# Altium schematic sheet v1.0.SchDoc
size 203 x 114 mm; PageSetup: Record=PageOptions|CenterHorizontal=True|CenterVertical=True|PrintScale=0.86|XCorrection=1.00|YCorrection=1.00|PrintKind=1|BorderSize=5000000|LeftOffset=0|BottomOffset=0|Orientation=2|PaperLength=1000|PaperWidth=1000|Scale=100|PaperSource=15|PrintQuality=3600|MediaType=1|DitherType=10|PrintScaleMode=1|PaperKind=A4|PaperIndex=9
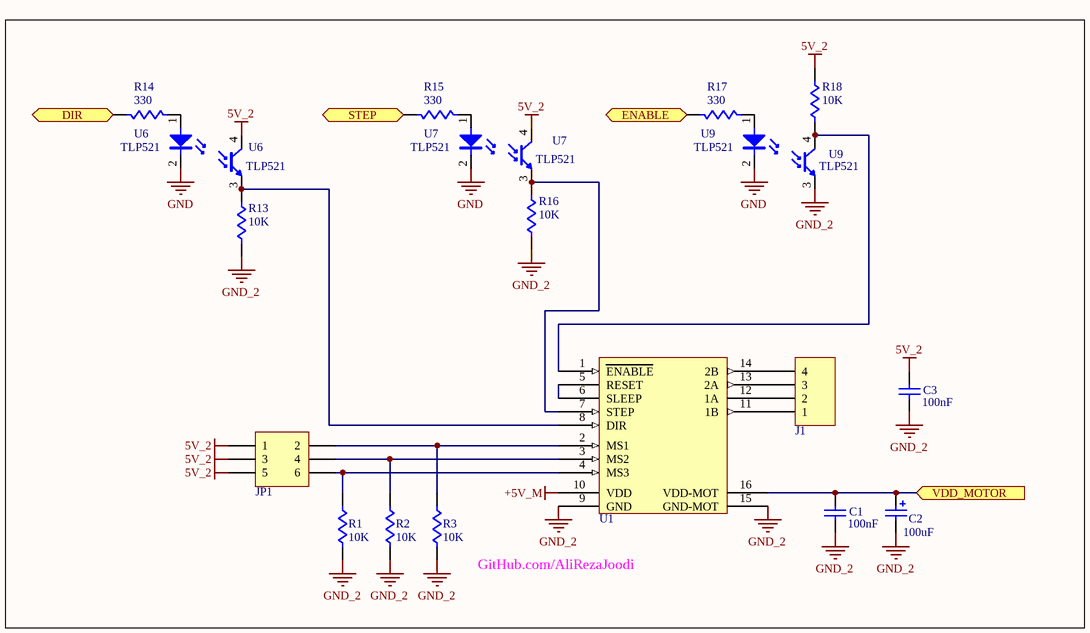
[diagram p0: v1.0.SchDoc]

## Parts
C1  C1  value 100nF  [CAPNTO2.54-3.05x1.78A]
C2  C2  value 100uF  [CAPPR3.05-3.81x6.35]
C3  C3  value 100nF  [CAPNTO2.54-3.05x1.78A]
J1  J1  [Fonics_4PIN_1]
JP1  JP1  [HDR2X3]
R1  R1  value 10K  [AXIAL-0.4]
R2  R2  value 10K  [AXIAL-0.4]
R3  R3  value 10K  [AXIAL-0.4]
R13  R13  value 10K  [AXIAL-0.4]
R14  R14  value 330  [AXIAL-0.4]
R15  R15  value 330  [AXIAL-0.4]
R16  R16  value 10K  [AXIAL-0.4]
R17  R17  value 330  [AXIAL-0.4]
R18  R18  value 10K  [AXIAL-0.4]
U1  U1  [Reprap-A4988]
U6  U6  value TLP521  [DIP4e]  (parts A,B of 2)
U7  U7  value TLP521  [DIP4e]  (parts A,B of 2)
U9  U9  value TLP521  [DIP4e]  (parts A,B of 2)

## Ports
DIR (in), ENABLE (in), STEP (in), VDD_MOTOR (in)

## Nets
5V_2: C3.1 JP1.1 JP1.3 JP1.5 R18.1 U6.4(C) U7.4(C)
+5V_M: U1.10(VDD)
GND: U6.2(K) U7.2(K) U9.2(K)
GND_2: C1.2 C2.2 C3.2 R1.2 R2.2 R3.2 R13.2 R16.2 U1.9(GND) U1.15(GND-MOT) U9.3(E)
DIR: R14.2 ; port DIR
ENABLE: R17.2 ; port ENABLE
STEP: R15.2 ; port STEP
VDD_MOTOR: C1.1 C2.1 U1.16(VDD-MOT) ; port VDD_MOTOR
NetJ1_1: J1.1 U1.11(1B)
NetJ1_2: J1.2 U1.12(1A)
NetJ1_3: J1.3 U1.13(2A)
NetJ1_4: J1.4 U1.14(2B)
NetJP1_2: JP1.2 R3.1 U1.2(MS1)
NetJP1_4: JP1.4 R2.1 U1.3(MS2)
NetJP1_6: JP1.6 R1.1 U1.4(MS3)
NetR13_1: R13.1 U1.8(DIR) U6.3(E)
NetR14_1: R14.1 U6.1(A)
NetR15_1: R15.1 U7.1(A)
NetR16_1: R16.1 U1.7(STEP) U7.3(E)
NetR17_1: R17.1 U9.1(A)
NetR18_2: R18.2 U1.1(ENABLE) U9.4(C)
NetU1_5: U1.5(RESET) U1.6(SLEEP)

## Notes on the sheet
- GitHub.com/AliRezaJoodi

## Library data of the parts
C1 C3 = Cap: Capacitor; Manufacturer: Generic Components; Class I: Passive; Published: 8-Jun-2000; Revision: July-2002: Re-released for DXP Platform.; Publisher: Altium Limited; Class II: Capacitor
C2 = Cap Pol1: Polarized Capacitor (Radial); Manufacturer: Generic Components; Class I: Passive; Published: 8-Jun-2000; Revision: July-2002: Re-released for DXP Platform.; Publisher: Altium Limited; Class II: Capacitor
J1 = Header 4: Header, 4-Pin; Manufacturer: Generic Components; Class I: Connector; Revision: July-2002: Re-released for DXP Platform.; Publisher: Altium Limited
JP1 = Header 3X2: Header, 3-Pin, Dual row; Manufacturer: Generic Components; Class I: Connector; Revision: July-2002: Re-released for DXP Platform.; Publisher: Altium Limited
R1-R3 R13-R18 = Res1: Resistor; Manufacturer: Generic Components; Class I: Passive; Published: 8-Jun-2000; Revision: July-2002: Re-released for DXP Platform.; Publisher: Altium Limited; Class II: Resistor
U1 = Reprap-A4988
U6 U7 U9 = Optoisolator: Publisher: Altium Limited